# Altium schematic sheet Sheet1.SchDoc
size A; SheetNumber: 1; SheetTotal: 1
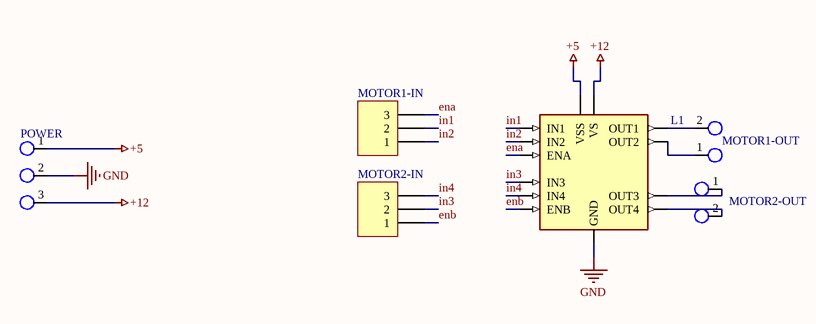
[diagram p0: Sheet1.SchDoc]

## Parts
L1  L293D  [L293D]  (value not drawn)
MOTOR1-IN  (no value)  [HDR1X3]
MOTOR1-OUT  (no value)  [AK300/2]
MOTOR2-IN  (no value)  [HDR1X3]
MOTOR2-OUT  (no value)  [AK300/2]
POWER  (no value)  [AK300/3]

## Nets
+5: L1.VSS POWER.1(KL)
+12: L1.VS POWER.3(KL)
GND: L1.GND POWER.2(KL)
ena: L1.ENA MOTOR1-IN.3
enb: L1.ENB MOTOR2-IN.1
in1: L1.IN1 MOTOR1-IN.2
in2: L1.IN2 MOTOR1-IN.1
in3: L1.IN3 MOTOR2-IN.2
in4: L1.IN4 MOTOR2-IN.3
NetL1_OUT1: L1.OUT1 MOTOR1-OUT.2(KL)
NetL1_OUT2: L1.OUT2 MOTOR1-OUT.1(KL)
NetL1_OUT3: L1.OUT3 MOTOR2-OUT.1(KL)
NetL1_OUT4: L1.OUT4 MOTOR2-OUT.2(KL)

## Library data of the parts
MOTOR1-IN MOTOR2-IN = Header 3: Header, 3-Pin; LatestRevisionDate: 17-Jul-2002; LatestRevisionNote: Re-released for DXP Platform.; Publisher: Altium Limited
MOTOR1-OUT MOTOR2-OUT = AK300/2: MP: AK300/3; MF: Altech; Package: None; Availability: Unavailable; SnapEDA_Link: https://www.snapeda.com/parts/AK300/3/Altech/view-part/2748485/?ref=snap; Check_prices: https://www.snapeda.com/parts/AK300/3/Altech/view-part/2748485/?ref=eda; Value: *; Price: None
POWER = AK300/3: MF: Altech; MP: AK300/3; Package: None; Availability: Unavailable; SnapEDA_Link: https://www.snapeda.com/parts/AK300/3/Altech/view-part/2748485/?ref=snap; Check_prices: https://www.snapeda.com/parts/AK300/3/Altech/view-part/2748485/?ref=eda; Value: *; Price: None